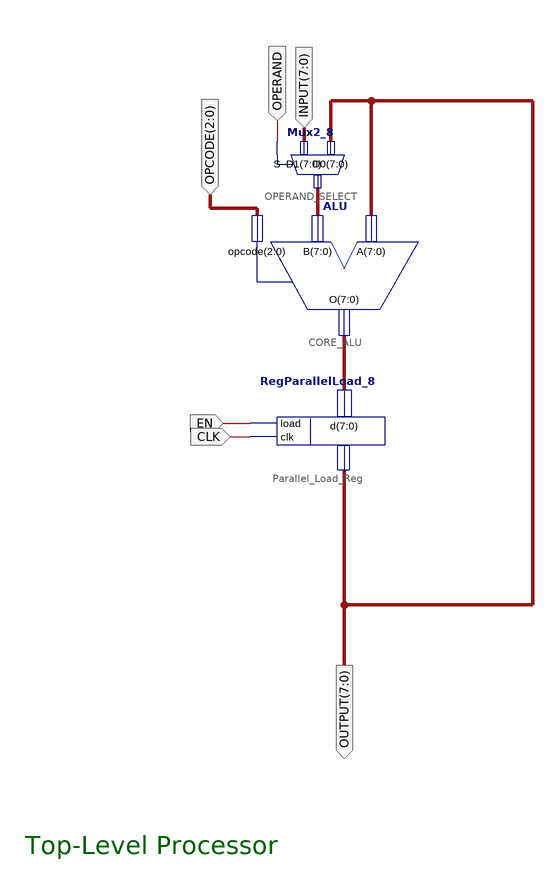
[diagram p0: schematic sheet 1]
// Xilinx ISE schematic MPP.sch (spartan6) as structural Verilog: 3 symbols, 6 ports
module MPP (
  input  OPERAND,
  input  [2:0] OPCODE,
  input  [7:0] INPUT,
  input  EN,
  input  CLK,
  output [7:0] OUTPUT
);

  wire [7:0] XLXN_8, XLXN_10;

  Mux2_8 OPERAND_SELECT (.O(XLXN_8), .D0(OUTPUT), .D1(INPUT), .S(OPERAND));
  ALU CORE_ALU (.A(OUTPUT), .B(XLXN_8), .O(XLXN_10), .opcode(OPCODE));
  RegParallelLoad_8 Parallel_Load_Reg (.clk(CLK), .q(OUTPUT), .load(EN), .d(XLXN_10));

  // Notes on the sheet:
  //   Top-Level Processor
endmodule
